# EAGLE design nano-shieldv4 (EAGLE 9.6.2)
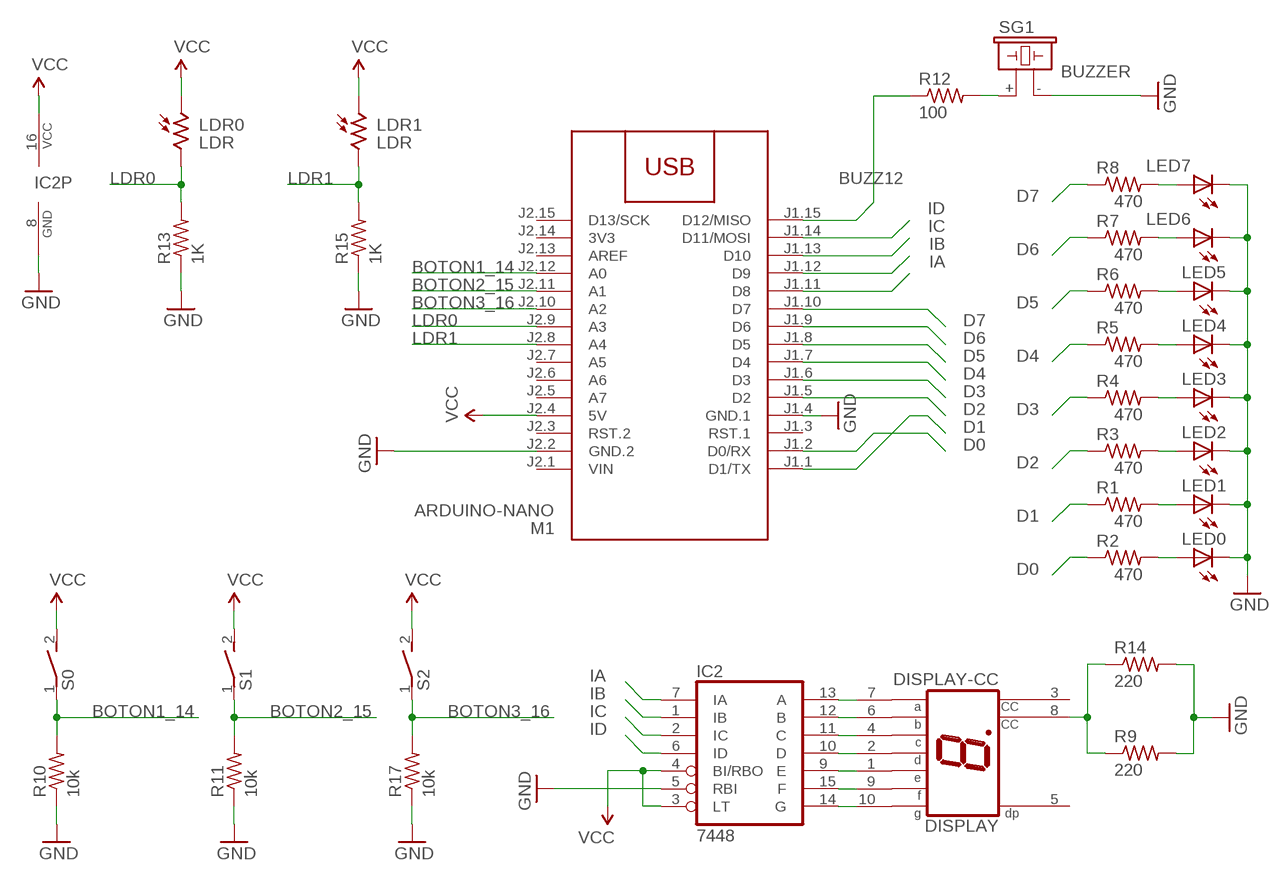
[diagram p0: schematic, sheet 1]

## Parts
DISPLAY  DISPLAY-CC  HD-H103  [HDSP-M]
IC2  7448  74LS48N  [DIL16]
LDR0  LDR  VT20N1  [TO46-VT200]
LDR1  LDR  VT20N1  [TO46-VT200]
LED0  LED5MM  [LED5MM]
LED1  LED5MM  [LED5MM]
LED2  LED5MM  [LED5MM]
LED3  LED5MM  [LED5MM]
LED4  LED5MM  [LED5MM]
LED5  LED5MM  [LED5MM]
LED6  LED5MM  [LED5MM]
LED7  LED5MM  [LED5MM]
M1  ARDUINO-NANO  ARDUINO-NANO-3.0  [ARDUINO-NANO-3.0]
R1  470  R-US_0207/10  [0207/10]
R2  470  R-US_0207/10  [0207/10]
R3  470  R-US_0207/10  [0207/10]
R4  470  R-US_0207/10  [0207/10]
R5  470  R-US_0207/10  [0207/10]
R6  470  R-US_0207/10  [0207/10]
R7  470  R-US_0207/10  [0207/10]
R8  470  R-US_0207/10  [0207/10]
R9  220  R-US_0207/10  [0207/10]
R10  10k  R-US_0207/10  [0207/10]
R11  10k  R-US_0207/10  [0207/10]
R12  100  R-US_0207/10  [0207/10]
R13  1K  R-US_0207/10  [0207/10]
R14  220  R-US_0207/10  [0207/10]
R15  1K  R-US_0207/10  [0207/10]
R17  10k  R-US_0207/10  [0207/10]
S0  DS01E  [DS-01]
S1  DS01E  [DS-01]
S2  DS01E  [DS-01]
SG1  BUZZER  F/CM12P  [F/CM12P]

## Nets
BOTON1_14: M1.J2.12(A0) R10.2 S0.1
BOTON2_15: M1.J2.11(A1) R11.2 S1.1
BOTON3_16: M1.J2.10(A2) R17.2 S2.1
BUZZ12: M1.J1.15(D12/MISO) R12.1
D0: M1.J1.2(D0/RX) R2.1
D1: M1.J1.1(D1/TX) R1.1
D2: M1.J1.5(D2) R3.1
D3: M1.J1.6(D3) R4.1
D4: M1.J1.7(D4) R5.1
D5: M1.J1.8(D5) R6.1
D6: M1.J1.9(D6) R7.1
D7: M1.J1.10(D7) R8.1
GND [ground]: IC2.5(RBI) IC2.8(GND) LED0.K(C) LED1.K(C) LED2.K(C) LED3.K(C) LED4.K(C) LED5.K(C) LED6.K(C) LED7.K(C) M1.J1.4(GND.1) M1.J2.2(GND.2) R9.2 R10.1 R11.1 R13.1 R14.2 R15.1 R17.1 SG1.-
IA: IC2.7(IA) M1.J1.11(D8)
IB: IC2.1(IB) M1.J1.12(D9)
IC: IC2.2(IC) M1.J1.13(D10)
ID: IC2.6(ID) M1.J1.14(D11/MOSI)
LDR0: LDR0.2 M1.J2.9(A3) R13.2
LDR1: LDR1.2 M1.J2.8(A4) R15.2
N$3: R12.2 SG1.+
N$9: LED0.A R2.2
N$10: LED1.A R1.2
N$11: LED2.A R3.2
N$12: LED3.A R4.2
N$13: LED4.A R5.2
N$14: LED5.A R6.2
N$15: LED6.A R7.2
N$16: LED7.A R8.2
N$17: DISPLAY.1(E) IC2.9(E)
N$18: DISPLAY.2(D) IC2.10(D)
N$19: DISPLAY.4(C) IC2.11(C)
N$20: DISPLAY.6(B) IC2.12(B)
N$21: DISPLAY.7(A) IC2.13(A)
N$22: DISPLAY.10(G) IC2.14(G)
N$23: DISPLAY.9(F) IC2.15(F)
N$24: DISPLAY.8(CC) R9.1 R14.1
VCC: IC2.3(LT) IC2.4(BI/RBO) IC2.16(VCC) LDR0.1 LDR1.1 M1.J2.4(5V) S0.2 S1.2 S2.2
Unconnected: DISPLAY.3(CC) DISPLAY.5(DP) M1.J1.3(RST.1) M1.J2.3(RST.2) M1.J2.5(A7) M1.J2.6(A6) M1.J2.7(A5) M1.J2.13(AREF) M1.J2.15(D13/SCK)

## Power pins joined to a net without a drawn wire
3V3: M1.J2.14(3V3)
VIN: M1.J2.1(VIN)

## Library data of the parts
DISPLAY = display-hp:HD-H103: LED DISPLAY 1-character 7 segment, decimal point right; OC_FARNELL: unknown; OC_NEWARK: unknown
IC2 = 74xx-us:74*48: BCD to seven segment DECODER/DRIVER
LDR0 LDR1 = photo-elements:VT2*: Photoconductive Cell VT200 Series Source: http://optoelectronics.perkinelmer.com/content/Datasheets/DTS_vt200seriesdatasheet.pdf
LED0 LED1-LED7 = led_omar:LED: LED OSRAM: - CHIPLED LG R971, LG N971, LY N971, LG Q971, LY Q971, LO R971, LY R971 LH N974, LH R974 LS Q976, LO Q976, LY Q976 LO Q996 - Hyper CHIPLED LW Q18S LB Q993, LB Q99A, LB R99A - SideLED LS A670, LO A670, LY A670, LG A670, LP A670 LB A673, LV A673, LT A673, LW A673 LH A674 LY A675 LS A676, LA A676, LO A676, LY A676, LW A676 LS A679, LY A679, LG A679 - Hyper Micro SIDELED® LS Y876, LA Y876, LO Y876, LY Y876 LT Y87S - SmartLED LW L88C, LW L88S LB L89C, LB L89S, LG L890 LS L89K, LO L89K, LY L89K LS L896, LA L896, LO L896, LY L896 - TOPLED LS T670, LO T670, LY T670, LG T670, LP T670 LSG T670, LSP T670, LSY T670, LOP T670, LYG T670 LG T671, LOG T671, LSG T671 LB T673, LV T673, LT T673, LW T673 LH T674 LS T676, LA T676, LO T676, LY T676, LB T676, LH T676, LSB T676, LW T676 LB T67C, LV T67C, LT T67C, LS T67K, LO T67K, LY T67K, LW E67C LS E67B, LA E67B, LO E67B, LY E67B, LB E67C, LV E67C, LT E67C LW T67C LS T679, LY T679, LG T679 LS T770, LO T770, LY T770, LG T770, LP T770 LB T773, LV T773, LT T773, LW T773 LH T774 LS E675, LA E675, LY E675, LS T675 LS T776, LA T776, LO T776, LY T776, LB T776 LHGB T686 LT T68C, LB T68C - Hyper Mini TOPLED® LB M676 - Mini TOPLED Santana® LG M470 LS M47K, LO M47K, LY M47K Source: http://www.osram.convergy.de LUXEON: - LUMILED® LXK2-PW12-R00, LXK2-PW12-S00, LXK2-PW14-U00, LXK2-PW14-V00 LXK2-PM12-R00, LXK2-PM12-S00, LXK2-PM14-U00 LXK2-PE12-Q00, LXK2-PE12-R00, LXK2-PE12-S00, LXK2-PE14-T00, LXK2-PE14-U00 LXK2-PB12-K00, LXK2-PB12-L00, LXK2-PB12-M00, LXK2-PB14-N00, LXK2-PB14-P00, LXK2-PB14-Q00 LXK2-PR12-L00, LXK2-PR12-M00, LXK2-PR14-Q00, LXK2-PR14-R00 LXK2-PD12-Q00, LXK2-PD12-R00, LXK2-PD12-S00 LXK2-PH12-R00, LXK2-PH12-S00 LXK2-PL12-P00, LXK2-PL12-Q00, LXK2-PL12-R00 Source: www.luxeon.com KINGBRIGHT: KA-3528ASYC Source: www.kingbright.com
M1 = diy-modules:ARDUINO-NANO-3.0: Arduino Nano 3.0
R1-R15 R17 = rcl_omar:R-US_: RESISTOR, American symbol
S0 S1 S2 = switch-dil:DS01E: DIL/CODE SWITCH; OC_FARNELL: unknown; OC_NEWARK: unknown
SG1 = buzzer:F/CM12P: BUZZER Source: Buerklin; OC_FARNELL: unknown; OC_NEWARK: unknown

## Net classes
0 default: width 0.406 mm
1 ground: width 0.61 mm

## Board
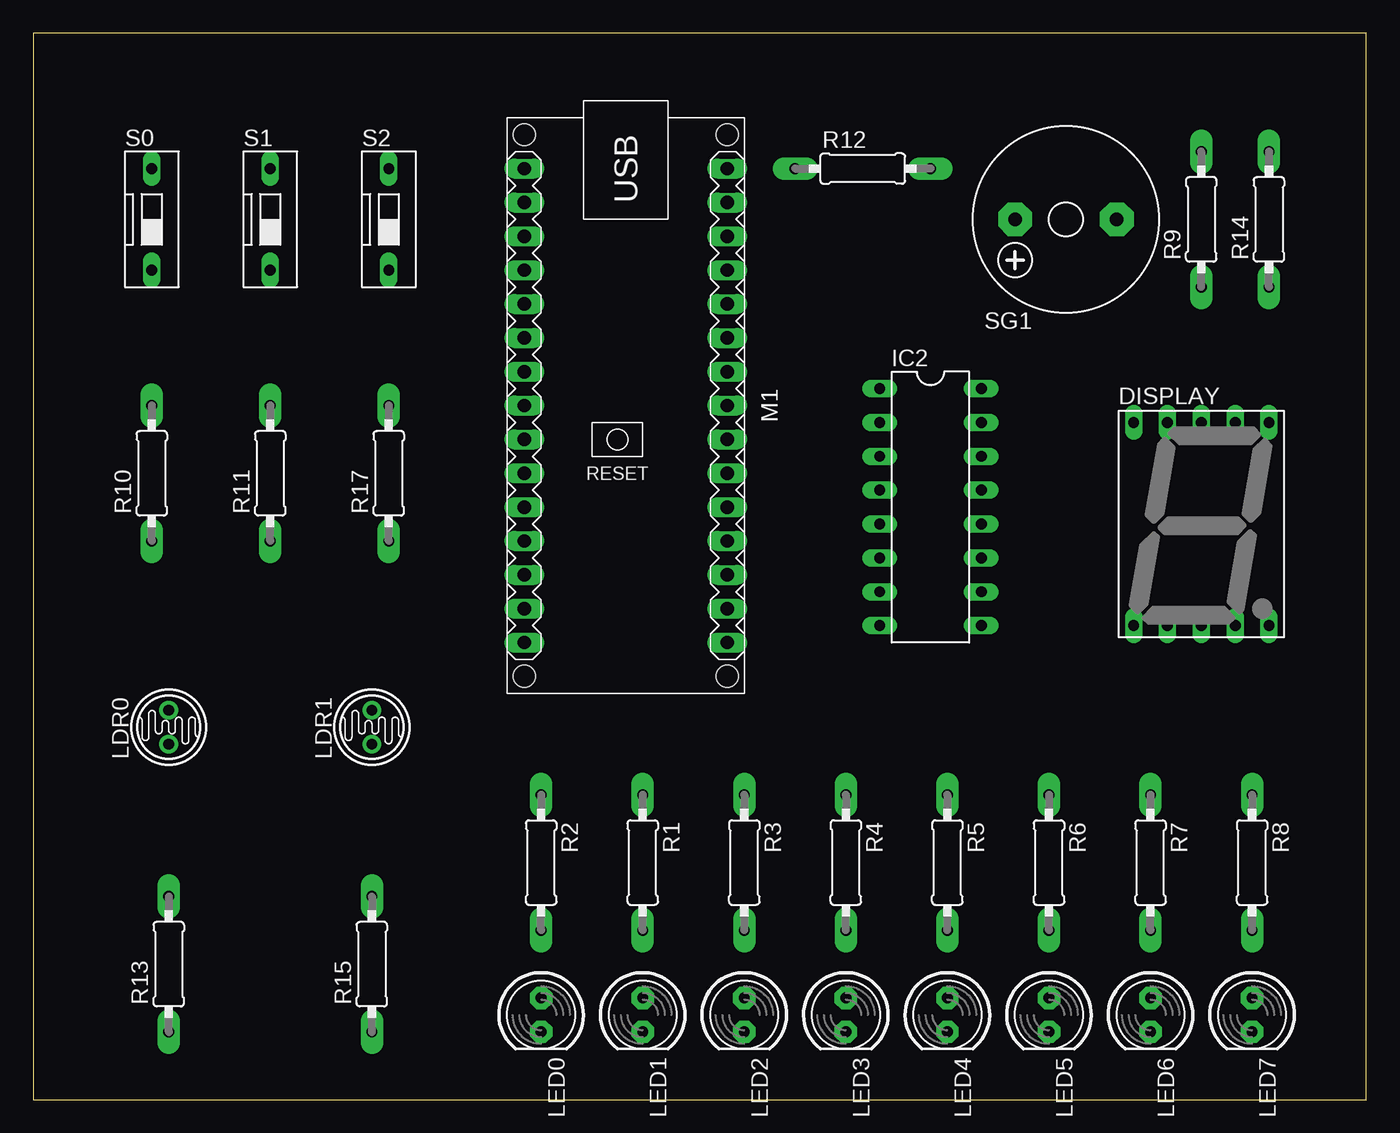
[diagram p1: board, top side]
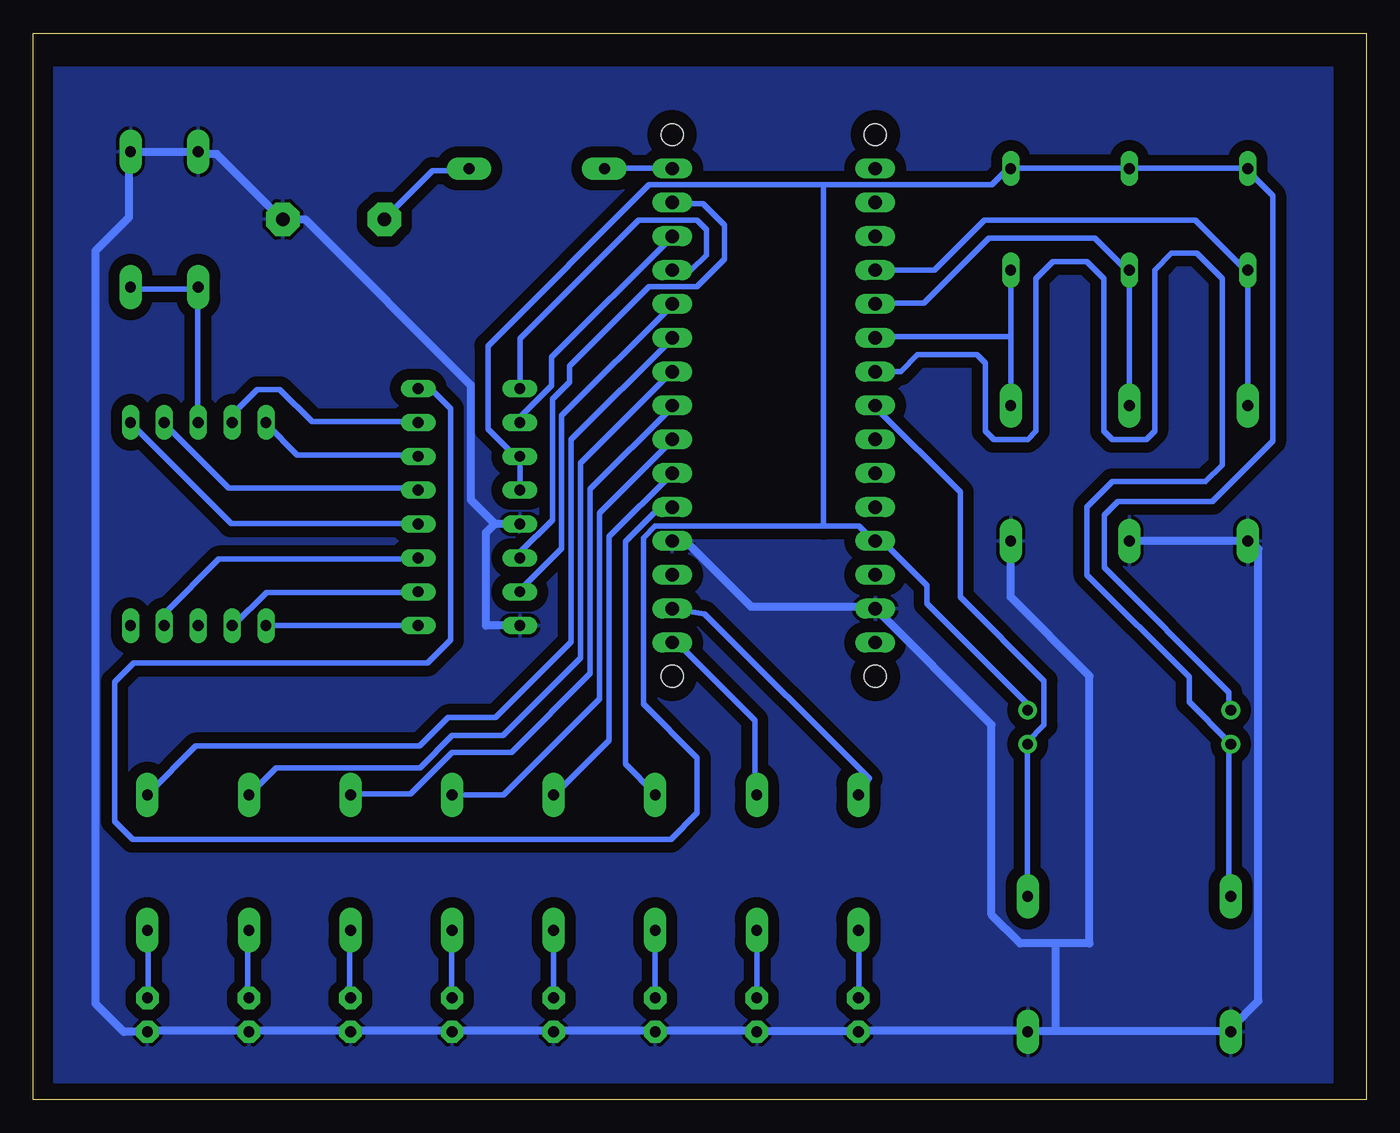
[diagram p2: board, bottom side, seen from below]

Size 100 x 80 mm. Coordinates in mm from the lower left corner, seen from the top.
Outline: 0,0 100,0 100,80 0,80 0,0
Copper layers (1*16): Top 0.035mm / dielectric 1.5mm / Bottom 0.035mm
Design rules "default *": minimum track width 6mil, minimum drill 0.35mm, track to track 12mil, track to pad 6mil, pad to pad 6mil, via to via 6mil, smd to smd 6mil, copper to edge 40mil, drill to drill 6mil, minimum pad ring 10mil, minimum via ring 8mil, stop-mask expansion 4mil, vias tented up to drill 0mil, thermal gap 10mil

### Footprints (pad centres in the part's own frame; a part is rotated, then mirrored left to right if it is on the bottom)
HDSP-M = drill 0.813 long: 1 -5.08,-7.62; 2 -2.54,-7.62; 3 0,-7.62; 4 2.54,-7.62; 5 5.08,-7.62; 6 5.08,7.62; 7 2.54,7.62; 8 0,7.62; 9 -2.54,7.62; 10 -5.08,7.62
DIL16 = drill 0.813 long: 1 -8.89,-3.81; 2 -6.35,-3.81; 3 -3.81,-3.81; 4 -1.27,-3.81; 5 1.27,-3.81; 6 3.81,-3.81; 7 6.35,-3.81; 8 8.89,-3.81; 9 8.89,3.81; 10 6.35,3.81; 11 3.81,3.81; 12 1.27,3.81; 13 -1.27,3.81; 14 -3.81,3.81; 15 -6.35,3.81; 16 -8.89,3.81
TO46-VT200 = drill 0.8 pad 1.4: 1 -1.27,0; 2 1.27,0
LED5MM = drill 0.813 pad 1.676 octagon: A -1.27,0; K 1.27,0
ARDUINO-NANO-3.0 = drill 1 long: J1.1 17.78,7.62; J1.2 15.24,7.62; J1.3 12.7,7.62; J1.4 10.16,7.62; J1.5 7.62,7.62; J1.6 5.08,7.62; J1.7 2.54,7.62; J1.8 0,7.62; J1.9 -2.54,7.62; J1.10 -5.08,7.62; J1.11 -7.62,7.62; J1.12 -10.16,7.62; J1.13 -12.7,7.62; J1.14 -15.24,7.62; J1.15 -17.78,7.62; J2.1 17.78,-7.62; J2.2 15.24,-7.62; J2.3 12.7,-7.62; J2.4 10.16,-7.62; J2.5 7.62,-7.62; J2.6 5.08,-7.62; J2.7 2.54,-7.62; J2.8 0,-7.62; J2.9 -2.54,-7.62; J2.10 -5.08,-7.62; J2.11 -7.62,-7.62; J2.12 -10.16,-7.62; J2.13 -12.7,-7.62; J2.14 -15.24,-7.62; J2.15 -17.78,-7.62 | hole 1.651: -20.32,7.62; -20.32,-7.62; 20.32,-7.62; 20.32,7.62
0207/10 = drill 0.813 pad 1.676 long: 1 -5.08,0; 2 5.08,0
DS-01 = drill 0.813 long: 1 0,-3.81; 2 0,3.81
F/CM12P = drill 1.016 pad 2.54 octagon: + 3.81,0; - -3.81,0

### Placement (x,y rotation side)
DISPLAY  87.63,43.18 0 top
IC2  67.31,44.45 270 top
LDR0  10.16,27.94 270 top
LDR1  25.4,27.94 270 top
LED0  38.1,6.35 270 top
LED1  45.72,6.35 270 top
LED2  53.34,6.35 270 top
LED3  60.96,6.35 270 top
LED4  68.58,6.35 270 top
LED5  76.2,6.35 270 top
LED6  83.82,6.35 270 top
LED7  91.44,6.35 270 top
M1  44.45,52.07 270 top
R1  45.72,17.78 270 top
R2  38.1,17.78 270 top
R3  53.34,17.78 270 top
R4  60.96,17.78 270 top
R5  68.58,17.78 270 top
R6  76.2,17.78 270 top
R7  83.82,17.78 270 top
R8  91.44,17.78 270 top
R9  87.63,66.04 90 top
R10  8.89,46.99 90 top
R11  17.78,46.99 90 top
R12  62.23,69.85 0 top
R13  10.16,10.16 90 top
R14  92.71,66.04 90 top
R15  25.4,10.16 90 top
R17  26.67,46.99 90 top
S0  8.89,66.04 0 top
S1  17.78,66.04 0 top
S2  26.67,66.04 0 top
SG1  77.47,66.04 180 top

### Tracks (layer width: path | path; a pad name or v marks a point on that pad's centre or on a via)
BOTON1_14
  Bottom 0.406: R10.2 S0.1 9.07,62.23 12.83,65.99 28.65,65.99 32.41,62.23 M1.J2.12
BOTON2_15
  Bottom 0.406: R11.2 S1.1 17.96,62.23 20.37,64.64 28.3,64.64 33.2,59.74 36.8,59.74 M1.J2.11
BOTON3_16
  Bottom 0.406: R17.2 26.67,57.25 | 26.67,57.25 S2.1 | 26.67,57.25 36.8,57.25 M1.J2.10
BUZZ12
  Bottom 0.406: M1.J1.15 52.09,69.88 57.07,69.88 R12.1
D0
  Bottom 0.406: M1.J1.2 49.63,36.42 37.29,24.08 R2.1
D1
  Bottom 0.406: M1.J1.1 51.92,34.14 51.56,34.14 45.87,28.45 45.87,22.94 R1.1
D2
  Bottom 0.406: M1.J1.5 52.98,44.45 55.58,41.86 55.58,25.17 53.34,22.94 R3.1
D3
  Bottom 0.406: M1.J1.6 52.09,46.94 56.79,42.24 56.79,26.95 60.81,22.94 R4.1
D4
  Bottom 0.406: M1.J1.7 52.09,49.43 57.51,44.02 57.51,30.07 64.72,22.86 R5.1
D5
  Bottom 0.406: M1.J1.8 52.09,51.92 58.22,45.8 58.22,31.95 64.14,26.04 68.58,26.04 71.68,22.94 76.1,22.94 R6.1
D6
  Bottom 0.406: M1.J1.9 58.93,47.75 58.93,33.15 64.77,27.3 68.58,27.3 70.99,24.89 81.79,24.89 R7.1
D7
  Bottom 0.406: M1.J1.10 52.09,57.07 59.64,49.53 59.64,34.34 65.33,28.65 68.88,28.65 71.01,26.52 87.81,26.52 91.39,22.94 R8.1
GND
  Bottom 0.61: IC2.8 66.06,35.56 66.06,42.52 65.41,43.18 IC2.5 65.35,43.18 67.18,45.01 67.18,53.62 79.6,66.04 SG1.- 81.43,66.14 86.23,70.94 87.48,70.94 R9.2 R14.2 92.81,70.94 92.81,66.19 95.33,63.68 95.33,7.19 93.22,5.08 LED7.K 91.39,5.16 84.1,5.16 LED6.K 83.74,5.16 76.45,5.16 LED5.K 76.1,5.16 68.81,5.16 LED4.K 68.45,5.16 61.16,5.16 LED3.K 60.81,5.16 53.52,5.16 LED2.K 53.34,5.16 45.87,5.16 LED1.K 45.7,5.16 38.23,5.16 LED0.K 37.87,5.16 25.6,5.16 R15.1 25.25,5.16 23.29,5.16 | M1.J1.4 51.08,41.91 46.16,36.98 36.98,36.98 M1.J2.2 28.12,28.12 28.12,13.87 25.96,11.71 23.29,11.71 | R11.1 17.78,41.96 8.89,41.96 R10.1 8.08,41.33 8.08,7.39 10.13,5.33 R13.1 10.31,5.16 23.29,5.16 | R17.1 26.67,37.69 20.75,31.77 20.75,11.71 23.29,11.71 | 23.29,5.16 23.29,11.71
  pour Bottom (isolate 0.813): 2.54,77.47 2.54,1.27 98.42,1.27 98.42,77.47
IA
  Bottom 0.406: IC2.7 63.48,38.23 60.35,41.35 60.35,51.31 52.09,59.56 M1.J1.11
IB
  Bottom 0.406: IC2.1 63.48,53.34 63.48,57.1 54.61,65.96 50.22,65.96 49.51,65.25 49.51,63.37 50.65,62.23 M1.J1.12
IC
  Bottom 0.406: IC2.2 63.48,50.85 63.48,51.21 61.11,53.57 61.11,55.7 52.09,64.72 M1.J1.13
ID
  Bottom 0.406: IC2.6 63.48,40.72 63.48,41.07 61.06,43.48 61.06,52.55 59.77,53.85 59.77,55.02 53.8,60.98 50.22,60.98 48.16,63.04 48.16,65.61 49.76,67.21 51.92,67.21 M1.J1.14
LDR0
  Bottom 0.406: R13.2 10.31,15.29 10.31,26.67 LDR0.2 10.31,26.85 13.28,29.82 13.28,31.7 20.95,39.37 20.95,44.45 19.05,46.35 12.06,46.35 10.79,47.62 10.79,61.59 12.7,63.5 14.61,63.5 15.88,62.23 15.88,50.16 16.51,49.53 19.05,49.53 19.68,50.16 19.68,61.59 20.95,62.87 23.5,62.87 24.77,61.59 24.77,50.16 25.4,49.53 27.94,49.53 28.57,50.16 28.57,55.24 29.21,55.88 33.66,55.88 34.92,54.61 M1.J2.9
LDR1
  Bottom 0.406: R15.2 25.43,15.29 25.43,26.67 LDR1.2 25.43,26.85 24.18,28.09 24.18,31.42 30.45,37.69 30.45,45.57 36.8,51.92 M1.J2.8
N$3
  Bottom 0.406: R12.2 67.39,69.7 70.05,69.7 73.61,66.14 SG1.+
N$9
  Bottom 0.406: LED0.A 38.05,7.64 38.05,12.62 R2.2
N$10
  Bottom 0.406: LED1.A 45.7,7.64 45.7,12.62 R1.2
N$11
  Bottom 0.406: R3.2 LED2.A
N$12
  Bottom 0.406: LED3.A 60.98,7.64 60.98,12.62 R4.2
N$13
  Bottom 0.406: LED4.A 68.63,7.64 68.63,12.62 R5.2
N$14
  Bottom 0.406: LED5.A 76.28,7.64 76.28,12.62 R6.2
N$15
  Bottom 0.406: LED6.A 83.92,7.64 83.92,12.62 R7.2
N$16
  Bottom 0.406: LED7.A 91.39,7.64 91.39,12.62 R8.2
N$17
  Bottom 0.406: DISPLAY.1 IC2.9
N$18
  Bottom 0.406: DISPLAY.2 84.99,35.56 82.5,38.05 71.12,38.05 IC2.10
N$19
  Bottom 0.406: DISPLAY.4 90.17,36.45 86.08,40.54 71.12,40.54 IC2.11
N$20
  Bottom 0.406: IC2.12 71.12,43.2 85.17,43.2 92.63,50.67 DISPLAY.6
N$21
  Bottom 0.406: IC2.13 71.12,45.87 85.34,45.87 90.14,50.67 DISPLAY.7
N$22
  Bottom 0.406: IC2.14 71.12,48.36 80.19,48.36 82.5,50.67 DISPLAY.10
N$23
  Bottom 0.406: DISPLAY.9 85.09,51.38 83.21,53.26 81.51,53.26 79.1,50.85 71.12,50.85 IC2.15
N$24
  Bottom 0.406: DISPLAY.8 87.66,50.85 87.66,60.81 R9.1 87.83,60.81 92.63,60.81 R14.1
VCC
  Bottom 0.406: IC2.4 63.48,45.87 63.48,48.18 IC2.3 63.83,48.26 65.89,50.32 65.89,56.54 53.8,68.63 40.72,68.63 | LDR0.1 10.31,29.34 10.31,30.56 19.66,39.9 19.66,43.84 18.62,44.88 11.53,44.88 7.01,49.4 7.01,67.82 8.89,69.7 S0.2 8.89,69.88 17.78,69.88 S1.2 17.96,69.88 26.67,69.88 S2.2 26.85,69.88 28.09,68.63 40.72,68.63 | IC2.16 70.21,53.34 68.71,51.84 68.71,34.47 70.41,32.77 92.48,32.77 93.9,31.34 93.9,20.88 92.56,19.53 52.17,19.53 50.19,21.51 50.19,25.63 54.23,29.67 54.23,42.14 53.34,43.03 40.72,43.03 | 40.72,43.03 38.05,43.03 36.98,41.96 M1.J2.4 36.3,41.91 32.94,38.56 32.94,37.21 25.43,29.69 25.43,29.34 LDR1.1 | 40.72,43.03 40.72,68.63